# EAGLE design octacore (EAGLE 9.0.0)
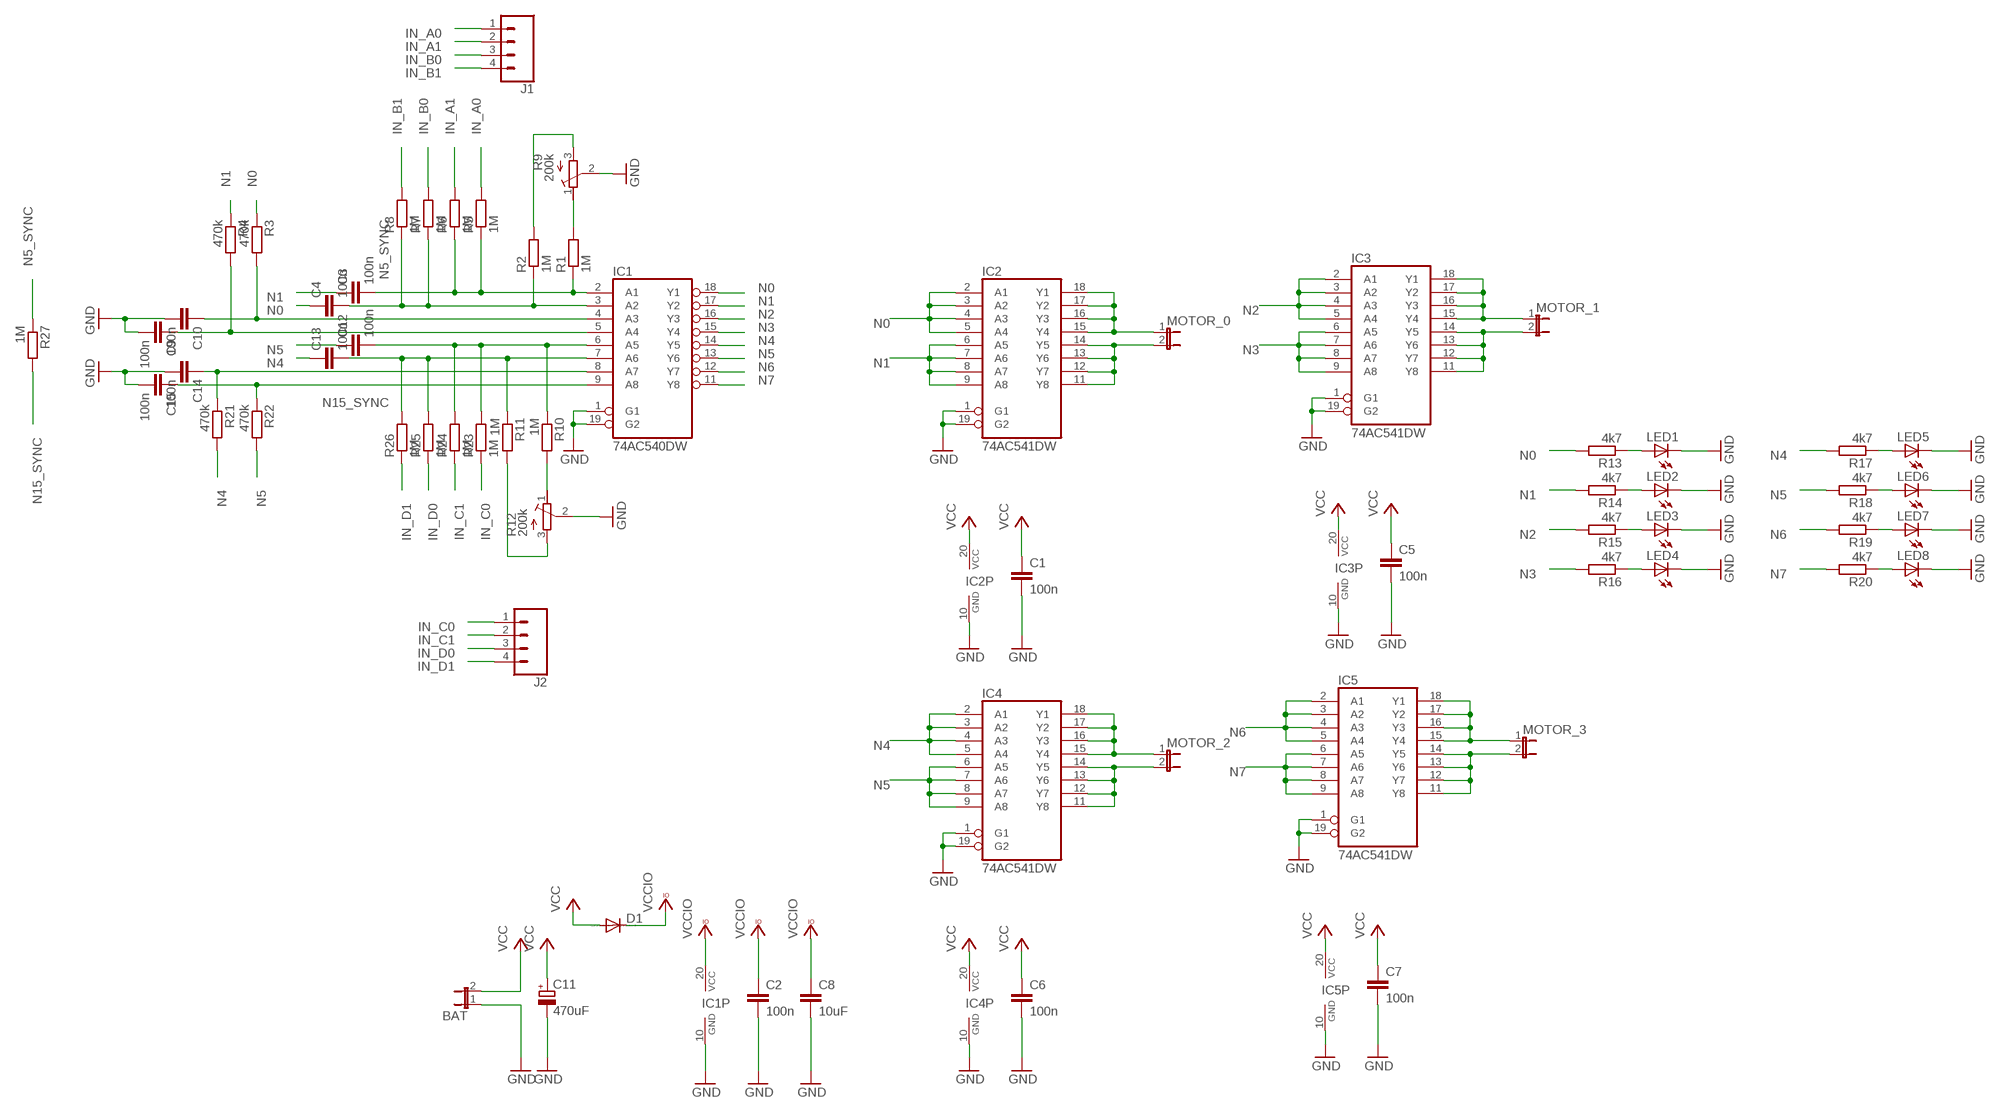
[diagram p0: schematic, sheet 1]

## Parts
BAT  JUMPER_JP1E  [JUMPER_JP1]
C1  100n  C-EUC0805  [C0805]
C2  100n  C-EUC0805  [C0805]
C3  100n  C-EUC0805  [C0805]
C4  100n  C-EUC0805  [C0805]
C5  100n  C-EUC0805  [C0805]
C6  100n  C-EUC0805  [C0805]
C7  100n  C-EUC0805  [C0805]
C8  10uF  C-EUC0805  [C0805]
C9  100n  C-EUC0805  [C0805]
C10  100n  C-EUC0805  [C0805]
C11  470uF  CPOL-EU140CLH-1010  [140CLH-1010]
C12  100n  C-EUC0805  [C0805]
C13  100n  C-EUC0805  [C0805]
C14  100n  C-EUC0805  [C0805]
C15  100n  C-EUC0805  [C0805]
D1  DIODE-DO214AA  [DO214AA]
IC1  74AC540DW  [SO20W]
IC2  74AC541DW  [SO20W]
IC3  74AC541DW  [SO20W]
IC4  74AC541DW  [SO20W]
IC5  74AC541DW  [SO20W]
J1  CONN_04  [1X04]
J2  CONN_04  [1X04]
LED1  LEDSML1206  [SML1206]
LED2  LEDSML1206  [SML1206]
LED3  LEDSML1206  [SML1206]
LED4  LEDSML1206  [SML1206]
LED5  LEDSML1206  [SML1206]
LED6  LEDSML1206  [SML1206]
LED7  LEDSML1206  [SML1206]
LED8  LEDSML1206  [SML1206]
MOTOR_0  JUMPER_JP1E  [JUMPER_JP1]
MOTOR_1  JUMPER_JP1E  [JUMPER_JP1]
MOTOR_2  JUMPER_JP1E  [JUMPER_JP1]
MOTOR_3  JUMPER_JP1E  [JUMPER_JP1]
R1  1M  R-EU_M0805  [M0805]
R2  1M  R-EU_M0805  [M0805]
R3  470k  R-EU_M0805  [M0805]
R4  470k  R-EU_M0805  [M0805]
R5  1M  R-EU_M0805  [M0805]
R6  1M  R-EU_M0805  [M0805]
R7  1M  R-EU_M0805  [M0805]
R8  1M  R-EU_M0805  [M0805]
R9  200k  R-TRIMM3314G  [RTRIM3314G]
R10  1M  R-EU_M0805  [M0805]
R11  1M  R-EU_M0805  [M0805]
R12  200k  R-TRIMM3314G  [RTRIM3314G]
R13  4k7  R-EU_M0805  [M0805]
R14  4k7  R-EU_M0805  [M0805]
R15  4k7  R-EU_M0805  [M0805]
R16  4k7  R-EU_M0805  [M0805]
R17  4k7  R-EU_M0805  [M0805]
R18  4k7  R-EU_M0805  [M0805]
R19  4k7  R-EU_M0805  [M0805]
R20  4k7  R-EU_M0805  [M0805]
R21  470k  R-EU_M0805  [M0805]
R22  470k  R-EU_M0805  [M0805]
R23  1M  R-EU_M0805  [M0805]
R24  1M  R-EU_M0805  [M0805]
R25  1M  R-EU_M0805  [M0805]
R26  1M  R-EU_M0805  [M0805]
R27  1M  R-EU_M0805  [M0805]

## Nets
GND: BAT.1 C1.2 C2.2 C5.2 C6.2 C7.2 C8.2 C9.2 C10.2 C11.- C14.2 C15.2 IC1.1(G1) IC1.10(GND) IC1.19(G2) IC2.1(G1) IC2.10(GND) IC2.19(G2) IC3.1(G1) IC3.10(GND) IC3.19(G2) IC4.1(G1) IC4.10(GND) IC4.19(G2) IC5.1(G1) IC5.10(GND) IC5.19(G2) LED1.C LED2.C LED3.C LED4.C LED5.C LED6.C LED7.C LED8.C R9.2(S) R12.2(S)
IN_A0: J1.1 R5.2
IN_A1: J1.2 R6.2
IN_B0: J1.3 R7.2
IN_B1: J1.4 R8.2
IN_C0: J2.1 R23.1
IN_C1: J2.2 R24.1
IN_D0: J2.3 R25.1
IN_D1: J2.4 R26.1
N0: C4.1 IC1.18(Y1) IC2.2(A1) IC2.3(A2) IC2.4(A3) IC2.5(A4) R3.1 R13.2
N1: C3.1 IC1.17(Y2) IC2.6(A5) IC2.7(A6) IC2.8(A7) IC2.9(A8) R4.1 R14.2
N2: IC1.16(Y3) IC3.2(A1) IC3.3(A2) IC3.4(A3) IC3.5(A4) R15.2
N3: IC1.15(Y4) IC3.6(A5) IC3.7(A6) IC3.8(A7) IC3.9(A8) R16.2
N4: C13.1 IC1.14(Y5) IC4.2(A1) IC4.3(A2) IC4.4(A3) IC4.5(A4) R17.2 R21.2
N5: C12.1 IC1.13(Y6) IC4.6(A5) IC4.7(A6) IC4.8(A7) IC4.9(A8) R18.2 R22.2
N5_SYNC: C3.2 IC1.2(A1) R1.1 R5.1 R6.1 R27.1
N6: IC1.12(Y7) IC5.2(A1) IC5.3(A2) IC5.4(A3) IC5.5(A4) R19.2
N7: IC1.11(Y8) IC5.6(A5) IC5.7(A6) IC5.8(A7) IC5.9(A8) R20.2
N15_SYNC: C12.2 IC1.6(A5) R10.1 R23.2 R24.2 R27.2
N$1: IC3.15(Y4) IC3.16(Y3) IC3.17(Y2) IC3.18(Y1) MOTOR_1.1
N$2: IC3.11(Y8) IC3.12(Y7) IC3.13(Y6) IC3.14(Y5) MOTOR_1.2
N$3: IC2.15(Y4) IC2.16(Y3) IC2.17(Y2) IC2.18(Y1) MOTOR_0.1
N$4: IC2.11(Y8) IC2.12(Y7) IC2.13(Y6) IC2.14(Y5) MOTOR_0.2
N$5: R10.2 R12.1(E)
N$6: C4.2 IC1.3(A2) R2.1 R7.1 R8.1
N$7: IC4.15(Y4) IC4.16(Y3) IC4.17(Y2) IC4.18(Y1) MOTOR_2.1
N$8: IC4.11(Y8) IC4.12(Y7) IC4.13(Y6) IC4.14(Y5) MOTOR_2.2
N$9: IC5.15(Y4) IC5.16(Y3) IC5.17(Y2) IC5.18(Y1) MOTOR_3.1
N$10: IC5.11(Y8) IC5.12(Y7) IC5.13(Y6) IC5.14(Y5) MOTOR_3.2
N$11: C10.1 IC1.4(A3) R3.2
N$12: C9.1 IC1.5(A4) R4.2
N$13: R2.2 R9.3(A)
N$14: R1.2 R9.1(E)
N$16: C13.2 IC1.7(A6) R11.1 R25.2 R26.2
N$18: R11.2 R12.3(A)
N$19: LED2.A R14.1
N$20: LED1.A R13.1
N$21: LED3.A R15.1
N$22: LED4.A R16.1
N$23: LED5.A R17.1
N$24: LED6.A R18.1
N$25: LED7.A R19.1
N$26: LED8.A R20.1
N$27: C14.1 IC1.8(A7) R21.1
N$29: C15.1 IC1.9(A8) R22.1
VCC: BAT.2 C1.1 C5.1 C6.1 C7.1 C11.+ D1.A IC2.20(VCC) IC3.20(VCC) IC4.20(VCC) IC5.20(VCC)
VCCIO: C2.1 C8.1 D1.C IC1.20(VCC)

## Library data of the parts
BAT MOTOR_0 MOTOR_1-MOTOR_3 = main_board:JUMPER_JP1E: JUMPER
C1-C10 C12-C15 = resistor:C-EU: CAPACITOR, European symbol
C11 = resistor:CPOL-EU: POLARIZED CAPACITOR, European symbol
D1 = diode:DIODE-: DIODE
IC1 = 74xx-eu:74*540: Inverting Octal BUFFER and LINE DRIVER, 3-state
IC2-IC5 = 74xx-eu:74*541: Octal BUFFER and LINE DRIVER, 3-state
J1 J2 = SparkFun-Connectors:CONN_04: Multi connection point. Often used as Generic Header-pin footprint for 0.1 inch spaced/style header connections On any of the 0.1 inch spaced packages, you can populate with these: Break Away Headers - Straight <https://www.sparkfun.com/products/116> (PRT-00116) Break Away Male Headers - Right Angle <https://www.sparkfun.com/products/553> (PRT-00553) Female Headers <https://www.sparkfun.com/products/115> (PRT-00115) Break Away Headers - Machine Pin <https://www.sparkfun.com/products/117> (PRT-00117) Break Away Female Headers - Swiss Machine Pin <https://www.sparkfun.com/products/743> (PRT-00743) For SCREWTERMINALS and SPRING TERMINALS visit here: Screw Terimnals on SparkFun.com <https://www.sparkfun.com/search/results?term=Screw+Terminals> (5mm/3.5mm/2.54mm spacing) This device is also useful as a general connection point to wire up your design to another part of your project. Our various solder wires solder well into these plated through hole pads. Hook-Up Wire - Assortment (Stranded, 22 AWG) <https://www.sparkfun.com/products/11375> (PRT-11375) Hook-Up Wire - Assortment (Solid Core, 22 AWG) <https://www.sparkfun.com/products/11367> (PRT-11367) View the entire wire category on our website here <https://www.sparkfun.com/categories/141> Special notes: Molex polarized connector foot print use with SKU : PRT-08231 with associated crimp pins and housings. 1MM SMD Version SKU: PRT-10208; PROD_ID: CONN-09696
LED1-LED8 = led:LED: LED OSRAM: - CHIPLED LG R971, LG N971, LY N971, LG Q971, LY Q971, LO R971, LY R971 LH N974, LH R974 LS Q976, LO Q976, LY Q976 LO Q996 - Hyper CHIPLED LW Q18S LB Q993, LB Q99A, LB R99A - SideLED LS A670, LO A670, LY A670, LG A670, LP A670 LB A673, LV A673, LT A673, LW A673 LH A674 LY A675 LS A676, LA A676, LO A676, LY A676, LW A676 LS A679, LY A679, LG A679 - Hyper Micro SIDELED® LS Y876, LA Y876, LO Y876, LY Y876 LT Y87S - SmartLED LW L88C, LW L88S LB L89C, LB L89S, LG L890 LS L89K, LO L89K, LY L89K LS L896, LA L896, LO L896, LY L896 - TOPLED LS T670, LO T670, LY T670, LG T670, LP T670 LSG T670, LSP T670, LSY T670, LOP T670, LYG T670 LG T671, LOG T671, LSG T671 LB T673, LV T673, LT T673, LW T673 LH T674 LS T676, LA T676, LO T676, LY T676, LB T676, LH T676, LSB T676, LW T676 LB T67C, LV T67C, LT T67C, LS T67K, LO T67K, LY T67K, LW E67C LS E67B, LA E67B, LO E67B, LY E67B, LB E67C, LV E67C, LT E67C LW T67C LS T679, LY T679, LG T679 LS T770, LO T770, LY T770, LG T770, LP T770 LB T773, LV T773, LT T773, LW T773 LH T774 LS E675, LA E675, LY E675, LS T675 LS T776, LA T776, LO T776, LY T776, LB T776 LHGB T686 LT T68C, LB T68C - Hyper Mini TOPLED® LB M676 - Mini TOPLED Santana® LG M470 LS M47K, LO M47K, LY M47K Source: http://www.osram.convergy.de LUXEON: - LUMILED® LXK2-PW12-R00, LXK2-PW12-S00, LXK2-PW14-U00, LXK2-PW14-V00 LXK2-PM12-R00, LXK2-PM12-S00, LXK2-PM14-U00 LXK2-PE12-Q00, LXK2-PE12-R00, LXK2-PE12-S00, LXK2-PE14-T00, LXK2-PE14-U00 LXK2-PB12-K00, LXK2-PB12-L00, LXK2-PB12-M00, LXK2-PB14-N00, LXK2-PB14-P00, LXK2-PB14-Q00 LXK2-PR12-L00, LXK2-PR12-M00, LXK2-PR14-Q00, LXK2-PR14-R00 LXK2-PD12-Q00, LXK2-PD12-R00, LXK2-PD12-S00 LXK2-PH12-R00, LXK2-PH12-S00 LXK2-PL12-P00, LXK2-PL12-Q00, LXK2-PL12-R00 Source: www.luxeon.com KINGBRIGHT: KA-3528ASYC Source: www.kingbright.com
R1-R8 R10 R11 R13-R27 = resistor:R-EU_: RESISTOR, European symbol
R9 R12 = resistor:R-TRIMM: Trimm resistor

## Board
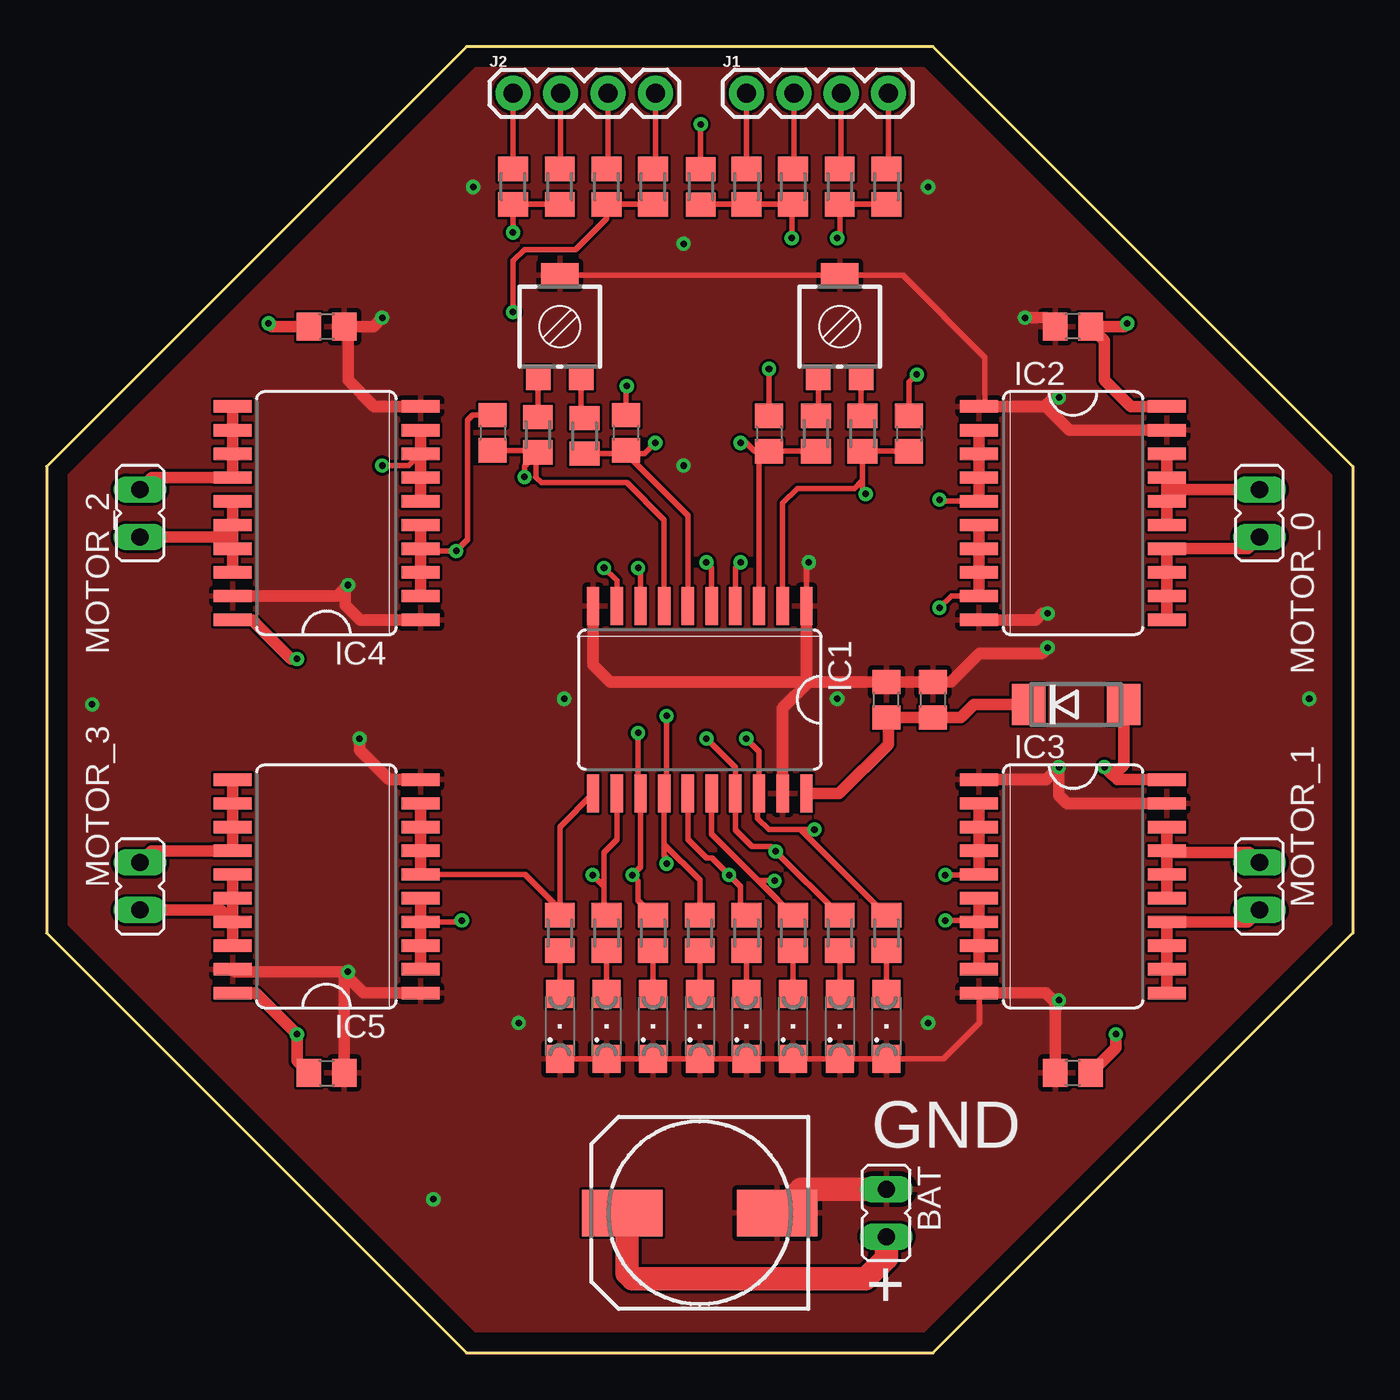
[diagram p1: board, top side]
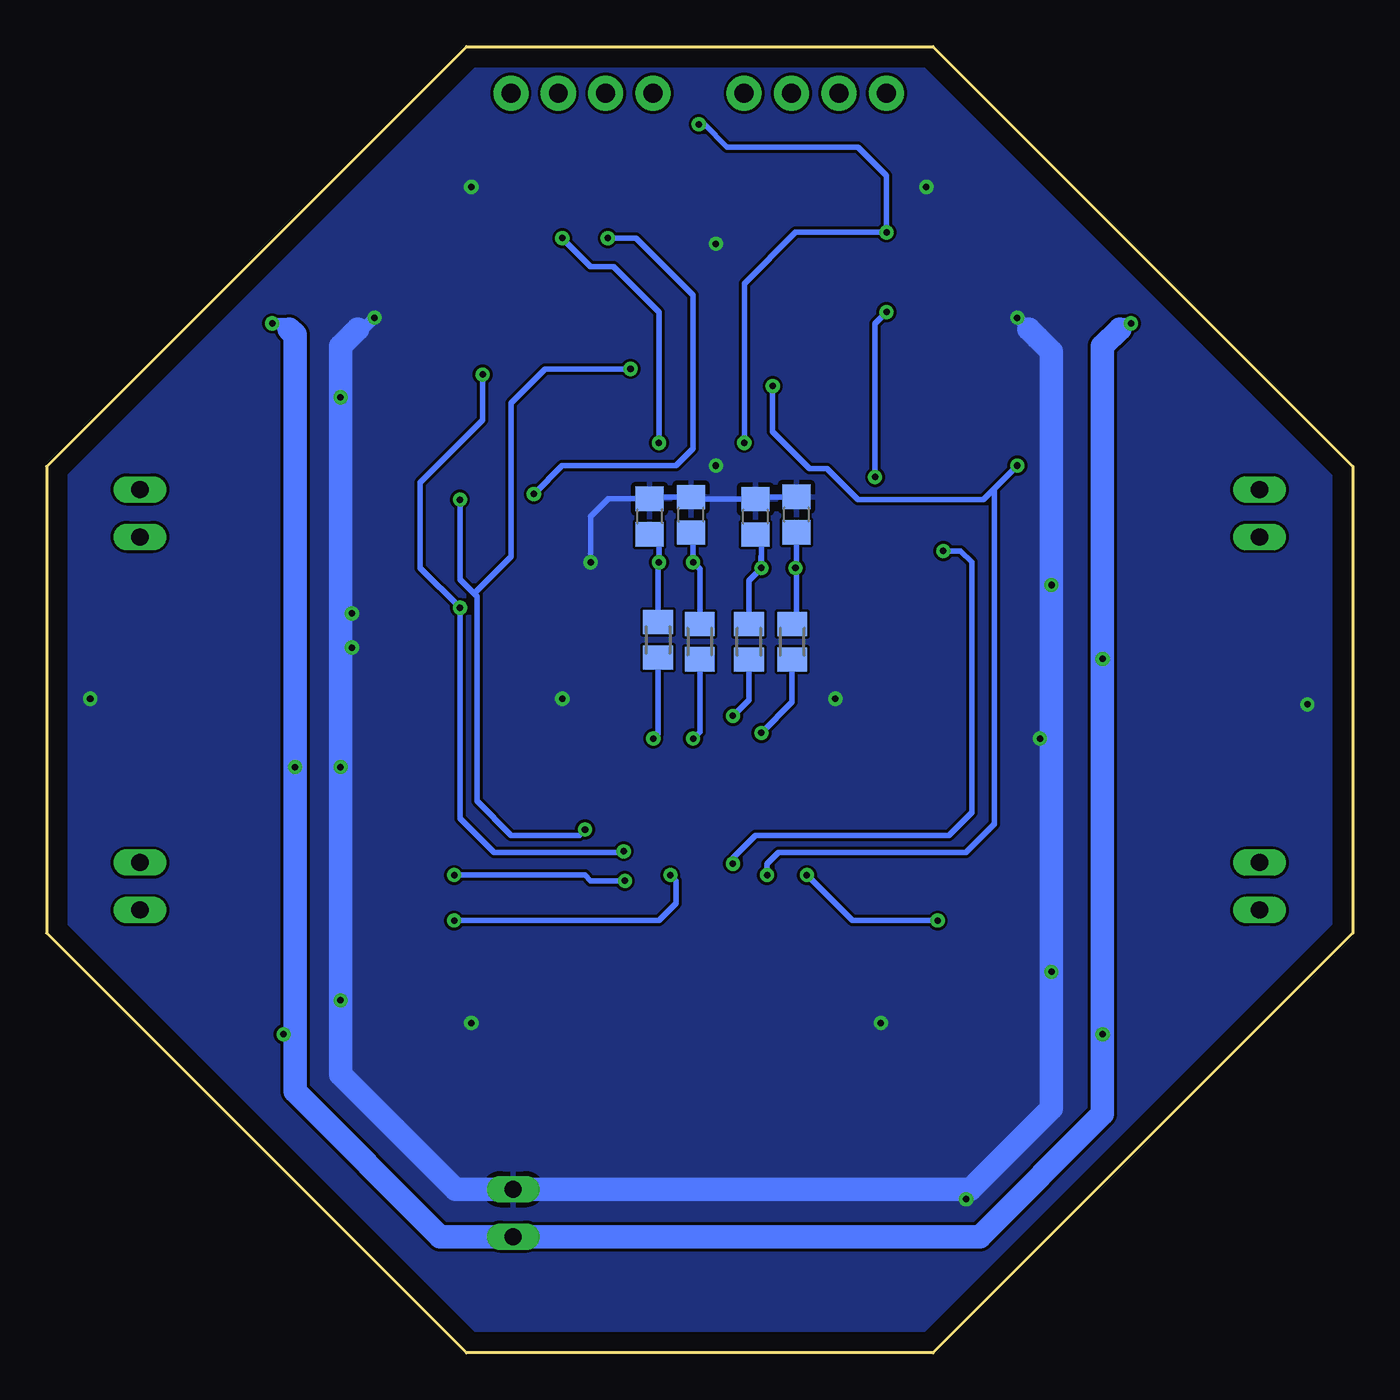
[diagram p2: board, bottom side, seen from below]

Size 70 x 70 mm. Coordinates in mm from the lower left corner, seen from the top.
Outline: 22.5,0 47.5,0 70,22.5 70,47.5 47.5,70 22.5,70 0,47.5 0,22.5 22.5,0
Copper layers (1*16): Top 0.035mm / dielectric 1.5mm / Bottom 0.035mm
Design rules "default": minimum track width 6mil, minimum drill 0.35mm, track to track 6mil, track to pad 6mil, pad to pad 6mil, via to via 6mil, smd to smd 6mil, copper to edge 40mil, drill to drill 6mil, minimum pad ring 10mil, minimum via ring 8mil, stop-mask expansion 4mil, vias tented up to drill 0mil, thermal gap 10mil

### Footprints (pad centres in the part's own frame; a part is rotated, then mirrored left to right if it is on the bottom)
JUMPER_JP1 = drill 0.914 long: 1 0,-1.27; 2 0,1.27
C0805 = smd 1.3 x 1.5: 1 -0.95,0; 2 0.95,0
140CLH-1010 = smd 4.3 x 2.5: + 4.15,0; - -4.15,0
DO214AA = smd 1.8 x 2.2: A 2.55,0; C -2.55,0
SO20W = smd 0.66 x 2.032: 1 -5.715,-5.029; 2 -4.445,-5.029; 3 -3.175,-5.029; 4 -1.905,-5.029; 5 -0.635,-5.029; 6 0.635,-5.029; 7 1.905,-5.029; 8 3.175,-5.029; 9 4.445,-5.029; 10 5.715,-5.029; 11 5.715,5.029; 12 4.445,5.029; 13 3.175,5.029; 14 1.905,5.029; 15 0.635,5.029; 16 -0.635,5.029; 17 -1.905,5.029; 18 -3.175,5.029; 19 -4.445,5.029; 20 -5.715,5.029
1X04 = drill 1.016 pad 1.88: 1 0,0; 2 2.54,0; 3 5.08,0; 4 7.62,0
SML1206 = smd 1.5 x 1.5: A 1.75,0; C -1.75,0
M0805 = smd 1.3 x 1.6: 1 -0.95,0; 2 0.95,0
RTRIM3314G = smd 1.3 x 1.3: 1 1.15,-2.75; 3 -1.15,-2.75 | smd 2 x 1.3: 2 0,2.75

### Placement (x,y rotation side)
BAT  45,7.5 180 top
C1  55,55 180 top
C2  47.5,35 90 top
C3  46.22,49.27 270 top
C4  38.72,49.27 270 top
C5  55,15 180 top
C6  15,15 0 top
C7  15,55 0 top
C8  45,35 90 top
C9  35.47,44.92 90 bottom
C10  37.68,44.82 90 bottom
C11  35,7.5 180 top
C12  31.04,49.31 270 top
C13  23.91,49.31 270 top
C14  32.01,44.8 90 bottom
C15  29.82,44.92 90 bottom
D1  55.17,34.75 0 top
IC1  35,35 180 top
IC2  55,45 270 top
IC3  55,25 270 top
IC4  15,45 90 top
IC5  15,25 90 top
J1  37.5,67.5 0 top
J2  25,67.5 0 top
LED1  45,17.5 90 top
LED2  42.5,17.5 90 top
LED3  40,17.5 90 top
LED4  37.5,17.5 90 top
LED5  35,17.5 90 top
LED6  32.5,17.5 90 top
LED7  30,17.5 90 top
LED8  27.5,17.5 90 top
MOTOR_0  65,45 180 top
MOTOR_1  65,25 180 top
MOTOR_2  5,45 0 top
MOTOR_3  5,25 0 top
R1  43.72,49.27 90 top
R2  41.22,49.27 90 top
R3  37.24,38.21 90 bottom
R4  35,38.11 90 bottom
R5  37.5,62.5 90 top
R6  40,62.5 90 top
R7  42.5,62.5 90 top
R8  45,62.5 90 top
R9  42.5,55 0 top
R10  28.82,49.14 90 top
R11  26.32,49.2 90 top
R12  27.5,55 0 top
R13  45,22.5 90 top
R14  42.5,22.5 90 top
R15  40,22.5 90 top
R16  37.5,22.5 90 top
R17  35,22.5 90 top
R18  32.5,22.5 90 top
R19  30,22.5 90 top
R20  27.5,22.5 90 top
R21  32.36,38.11 270 bottom
R22  30.05,38.11 270 bottom
R23  25,62.5 270 top
R24  27.5,62.5 270 top
R25  30,62.5 270 top
R26  32.5,62.5 270 top
R27  35.05,62.48 90 top

### Tracks (layer width: path | path; a pad name or v marks a point on that pad's centre or on a via)
GND  (via drill 0.35)
  Top 0.305: LED8.C LED7.C LED6.C LED5.C LED4.C LED3.C LED2.C LED1.C 48.06,15.75 49.99,17.68 49.99,19.29 | IC1.1 40.72,42.24 v40.84,42.37 | 50.29,50.72 50.29,53.34 45.88,57.75 R9.2 R12.2
  Top 0.61: C7.2 16.15,55 | 16.15,55 17.51,55 v17.98,55.47 | IC4.10 17.56,50.72 16.15,52.12 16.15,55 | IC4.19 15.56,40.55 16,41 | 16,41 v16.15,41.15 | IC4.1 16.8,39.28 16,40.08 16,41 | IC5.19 10.1,20.42 15.85,20.42 | 15.85,20.42 v16.15,20.42 | IC5.1 16.99,19.29 16,20.27 | 16,20.27 15.85,20.42 | C6.2 15.95,20.22 16,20.27 | IC3.10 49.99,19.29 53.56,19.29 53.95,18.9 v54.25,18.9 54.05,18.69 C5.2 | IC3.1 53.58,30.71 v54.25,31.39 54.25,29.87 54.68,29.45 IC3.19 | IC2.1 50.29,50.72 53.46,50.72 53.65,50.9 | 53.65,50.9 53.95,51.21 v54.25,51.21 | IC2.19 54.8,49.45 53.65,50.6 53.65,50.9 | v52.43,55.47 53.58,55.47 C1.2 | IC2.10 53,39.28 53.34,39.62 v53.65,39.62 | IC1.10 29.29,36.86 30.19,35.95 40.84,35.95 | 40.84,35.95 C8.2 C2.2 48.45,35.95 49.99,37.49 53.34,37.49 v53.65,37.8 | IC1.1 40.72,36.08 40.84,35.95 | IC1.19 39.45,34.55 40.84,35.95 | IC5.10 18.36,30.71 16.76,32.31 v16.76,32.92
  Top 1.27: BAT.1 40.42,8.77 C11.-
  Bottom 0.305: C15.2 31.89,45.87 C14.2 35.35,45.75 C9.2 37.58,45.87 C10.2 39.88,45.77 40.84,44.81 v40.84,42.37
  Bottom 0.61: v17.98,55.47 16.92,54.41 | 53.34,54.86 53.03,54.86 v52.43,55.47 | v53.65,39.62 54.25,39.62 | v53.65,37.8 54.25,37.8 | v16.76,32.92 16.15,32.92
  Bottom 1.27: 17.37,54.86 16.92,54.41 16.15,53.65 v16.15,41.15 16.15,32.92 v16.15,20.42 16.15,13.11 20.49,8.77 BAT.1 48.09,8.77 54.25,14.94 v54.25,18.9 v54.25,31.39 54.25,37.8 54.25,39.62 v54.25,51.21 54.25,53.95 53.34,54.86
  other vias: 27.74,35.05 42.37,35.05 20.73,8.23 67.67,35.05 2.44,34.75 47.24,17.68 25.3,17.68 34.14,59.44 22.86,62.48 47.24,62.48 34.14,47.55
  pour Top: -6.1,77.11 71.63,77.11 71.63,-3.96 -6.1,-3.96
  pour Bottom: -6.71,72.24 71.02,72.24 71.02,-4.27 -6.71,-4.27
IN_A0
  Top 0.305: J1.1 R5.2
IN_A1
  Top 0.305: J1.2 40.04,63.49 R6.2
IN_B0
  Top 0.305: J1.3 42.58,63.53 R7.2
IN_B1
  Top 0.305: J1.4 45.12,63.57 R8.2
IN_C0
  Top 0.305: J2.1 R23.1
IN_C1
  Top 0.305: J2.2 27.54,63.49 R24.1
IN_D0
  Top 0.305: J2.3 30.08,63.53 R25.1
IN_D1
  Top 0.305: J2.4 32.62,63.57 R26.1
N0  (via drill 0.35)
  Top 0.305: R13.2 40.41,28.04 | 40.41,28.04 38.71,28.04 38.1,28.65 38.1,29.9 IC1.18 38.17,32.23 v37.49,32.92 | IC2.5 47.94,45.63 v47.85,45.72 | 40.41,28.04 v41.15,28.04 | C4.1 v38.71,52.73
  Top 0.61: IC2.2 IC2.3 IC2.4 IC2.5
  Bottom 0.305: v47.85,45.72 47.85,41.45 47.09,40.69 | 47.09,40.69 46.94,40.54 46.94,29.57 45.11,27.74 41.45,27.74 v41.15,28.04 | v38.71,52.73 43.28,52.73 45.11,50.9 45.11,42.67 47.09,40.69 | R3.1 37.24,33.17 v37.49,32.92
N1  (via drill 0.35)
  Top 0.305: R14.2 v39.07,26.88 38.82,27.13 37.8,27.13 36.91,28.02 IC1.17 36.91,31.37 v35.36,32.92 | IC2.9 48.48,40.55 v47.85,39.93 | C3.1 46.22,52.01 v46.63,52.43
  Top 0.61: IC2.6 IC2.7 IC2.8 IC2.9
  Bottom 0.305: v39.07,26.88 39.13,26.82 46.02,26.82 47.85,28.65 v47.85,39.93 49.99,42.06 49.99,46.63 46.63,49.99 v46.63,52.43 | R4.1 35,33.27 v35.36,32.92
N2  (via drill 0.35)
  Top 0.305: 38.13,25.32 R15.2 38.41,25.05 | 38.13,25.32 35.63,27.82 IC1.16 | v48.16,25.6 49.94,25.6 IC3.5 | 38.13,25.32 38.99,25.32 v39.01,25.3
  Top 0.61: IC3.2 IC3.3 IC3.4 IC3.5
  Bottom 0.305: v48.16,25.6 41.15,25.6 40.84,25.3 v39.01,25.3
N3  (via drill 0.35)
  Top 0.305: R16.2 37.19,23.76 37.19,24.99 v36.58,25.6 35.66,26.52 35.36,26.52 34.37,27.51 IC1.15 | IC3.7 49.9,23.16 v48.16,23.16
  Top 0.61: IC3.6 IC3.7 IC3.8 IC3.9
  Bottom 0.305: v48.16,23.16 37.19,23.16 36.27,24.08 36.27,25.3 v36.58,25.6
N4  (via drill 0.35)
  Top 0.305: IC1.14 33.09,27.25 35,25.35 R17.2 | IC1.14 33.09,26.65 33.22,26.52 v33.22,26.21 | 20.03,42.98 v21.95,42.98 22.55,43.59 22.55,49.99 22.83,50.26 C13.1 | v33.22,34.14 33.22,30.1 IC1.14
  Top 0.61: IC4.2 IC4.3 20.03,42.98 IC4.4 IC4.5
  Bottom 0.305: v33.22,26.21 33.22,26.52 32,27.74 21.64,27.74 20.42,28.96 20.42,42.37 21.03,42.98 v21.95,42.98 | R21.2 32.36,35 v33.22,34.14
N5  (via drill 0.35)
  Top 0.305: IC1.13 31.82,26.09 | IC1.13 31.82,26.03 v31.39,25.6 31.7,25.3 31.7,24.25 R18.2 | C12.1 31.04,51.77 v31.09,51.82 | v17.98,47.55 19.4,47.55 IC4.8 | v31.7,33.22 31.7,30.1 IC1.13
  Top 0.61: IC4.9 IC4.8 IC4.7 IC4.6
  Bottom 0.305: v31.39,25.6 31.39,26.21 30.79,26.82 20.73,26.82 19.2,28.35 19.2,46.33 | 19.2,46.33 v17.98,47.55 | v31.09,51.82 31.09,49.38 29.11,47.4 28.19,47.4 26.52,45.72 19.81,45.72 19.2,46.33 | R22.2 30.05,34.88 v31.7,33.22
N5_SYNC  (via drill 0.35)
  Top 0.305: R27.1 35.07,61.55 R5.1 R6.1 39.93,61.48 v39.93,59.74 | IC1.2 39.45,45.54 40.23,46.33 43.28,46.33 43.72,46.77 43.72,48.16 | 43.72,48.16 R1.1 43.72,46.2 v43.89,46.02 | C3.2 43.88,48.32 43.72,48.16
  Bottom 0.305: v43.89,46.02 42.37,47.55 36.27,47.55 35.36,48.46 35.36,56.69 38.41,59.74 v39.93,59.74
N6  (via drill 0.35)
  Top 0.305: IC1.12 30.55,27.51 29.87,26.82 29.87,24.99 | R19.2 29.87,23.58 29.87,24.99 | 29.87,24.99 v29.26,25.6 | v22.25,23.16 22.18,23.09 IC5.4
  Top 0.61: IC5.2 IC5.3 IC5.4 IC5.5
  Bottom 0.305: v29.26,25.6 26.82,23.16 v22.25,23.16
N7
  Top 0.305: IC1.11 27.5,28.19 27.5,23.77 | 27.5,23.77 R20.2 | IC5.6 25.64,25.64 27.5,23.77
  Top 0.61: IC5.9 IC5.8 IC5.7 IC5.6
N15_SYNC  (via drill 0.35)
  Top 0.305: R24.2 R23.2 v25,60.05 v24.99,60.05 | R27.2 v35.05,65.84 | 30.96,48.28 30.87,48.19 R10.1 32.04,48.19 v32.61,48.77 | 30.96,48.28 C12.2 | 30.96,48.28 34.37,44.88 IC1.6
  Bottom 0.305: v35.05,65.84 34.75,65.84 33.53,64.62 26.52,64.62 24.99,63.09 v24.99,60.05 29.87,60.05 32.61,57.3 v32.61,48.77
N$1
  Top 0.61: IC3.17 60.11,26.82 64.45,26.82 MOTOR_1.1 | IC3.15 IC3.16 IC3.17 | IC3.17 IC3.18
N$2
  Top 0.61: IC3.11 IC3.12 IC3.13 IC3.14 64.36,23.09 MOTOR_1.2
N$3
  Top 0.61: IC2.18 IC2.17 60.03,46.02 | 60.03,46.02 IC2.16 IC2.15 | MOTOR_0.1 60.27,46.27 60.03,46.02
N$4
  Top 0.61: IC2.11 IC2.12 IC2.13 IC2.14 64.36,43.09 MOTOR_0.2
N$5
  Top 0.305: R12.1 28.65,50.26 R10.2
N$6  (via drill 0.35)
  Top 0.305: R8.1 R7.1 42.5,59.87 v42.37,59.74 | IC1.3 38.17,47.77 C4.2 R2.1 37.94,48.32 37.49,48.77 v37.19,48.77
  Bottom 0.305: v37.19,48.77 37.19,55.78 39.62,58.22 40.84,58.22 v42.37,59.74
N$7
  Top 0.305: IC4.17 9.97,43.26 9.51,43.73 | IC4.16 9.97,44.2
  Top 0.61: IC4.18 9.97,44.2 | 9.97,44.2 IC4.15 | MOTOR_2.1 9.51,43.73 9.97,44.2
N$8
  Top 0.61: IC4.14 9.75,46.91 | 9.75,46.91 5.63,46.91 MOTOR_2.2 | 9.75,46.91 9.97,47.12 IC4.13 IC4.12 IC4.11
N$9
  Top 0.61: IC5.15 IC5.16 IC5.17 | IC5.17 IC5.18 | MOTOR_3.1 9.34,23.73 IC5.17
N$10
  Top 0.61: IC5.11 IC5.12 IC5.13 IC5.14 5.63,26.91 MOTOR_3.2
N$11  (via drill 0.35)
  Top 0.305: IC1.4 36.91,42.09 v37.19,42.37
  Bottom 0.305: C10.1 37.19,43.37 v37.19,42.37 37.24,42.31 R3.2
N$12  (via drill 0.35)
  Top 0.305: IC1.5 35.63,42.09 v35.36,42.37
  Bottom 0.305: 35.3,42.42 v35.36,42.37 | v35.36,42.37 35.36,43.85 C9.1 | R4.2 35,42.01 v35.36,42.37
N$13
  Top 0.305: R9.3 41.35,50.35 R2.2
N$14
  Top 0.305: R9.1 43.65,50.29 R1.2
N$16  (via drill 0.35)
  Top 0.305: R26.2 R25.2 30,60.78 28.35,59.13 25.6,59.13 24.99,58.52 v24.99,55.78 | C13.2 26.22,48.36 | 26.22,48.36 R11.1 25.6,47.53 v25.6,46.94 | IC1.7 33.09,44.63 31.09,46.63 26.52,46.63 26.21,46.94 26.22,46.94 26.22,48.36
  Bottom 0.305: v25.6,46.94 25.6,55.17 v24.99,55.78
N$18
  Top 0.305: R12.3 26.32,52.22 R11.2
N$19
  Top 0.305: R14.1 LED2.A
N$20
  Top 0.305: R13.1 LED1.A
N$21
  Top 0.305: R15.1 LED3.A
N$22
  Top 0.305: R16.1 LED4.A
N$23
  Top 0.305: R17.1 LED5.A
N$24
  Top 0.305: R18.1 LED6.A
N$25
  Top 0.305: R19.1 LED7.A
N$26
  Top 0.305: R20.1 LED8.A
N$27  (via drill 0.35)
  Top 0.305: IC1.8 31.82,41.94 v31.7,42.06
  Bottom 0.305: 31.71,42.67 v31.7,42.06 | v31.7,42.06 31.7,43.53 C14.1 | R21.1 32.36,41.4 v31.7,42.06
N$29  (via drill 0.35)
  Top 0.305: 30.48,40.1 IC1.9 30.55,41.38 v29.87,42.06
  Bottom 0.305: R22.1 29.82,39.28 29.82,42.11 | C15.1 29.82,42.67 29.82,42.11 | v29.87,42.06 29.82,42.11
VCC  (via drill 0.35)
  Top 0.61: C7.1 12.06,55 v11.89,55.17 | IC4.20 11.01,39.28 13.11,37.19 v13.41,37.19 | IC5.20 11.2,19.29 v13.41,17.07 13.41,15.64 C6.1 | IC3.20 57.37,30.71 57.15,30.94 | 57.15,30.94 v56.69,31.39 | C5.1 57.3,16.35 v57.3,17.07 | IC2.20 58.1,50.72 56.69,52.12 56.69,54.26 C1.1 57.74,55 v57.91,55.17 | D1.A 57.72,31.51 57.15,30.94
  Top 1.27: BAT.2 45,5.07 43.89,3.96 31.39,3.96 31.09,4.27 31.09,7.26 C11.+
  Bottom 0.61: v11.89,55.17 12.19,55.17 12.5,54.86 | v57.3,17.07 56.69,17.07 | v57.91,55.17 57.3,55.17 56.69,54.56
  Bottom 1.27: 12.5,54.86 13.41,53.95 v13.41,37.19 v13.41,17.07 13.41,12.8 19.98,6.23 BAT.2 48.9,6.23 56.69,14.02 56.69,17.07 v56.69,31.39 56.69,54.56 57,54.86
VCCIO
  Top 0.61: C8.1 45.11,34.05 | 45.11,34.05 C2.1 48.98,34.05 49.68,34.75 D1.C | IC1.20 42.47,29.97 45.11,32.61 45.11,34.05

### Text on the board
tNames: GND | +